# Altium schematic sheet sensor.SchDoc
size B; SheetNumber: 1; SheetTotal: 7
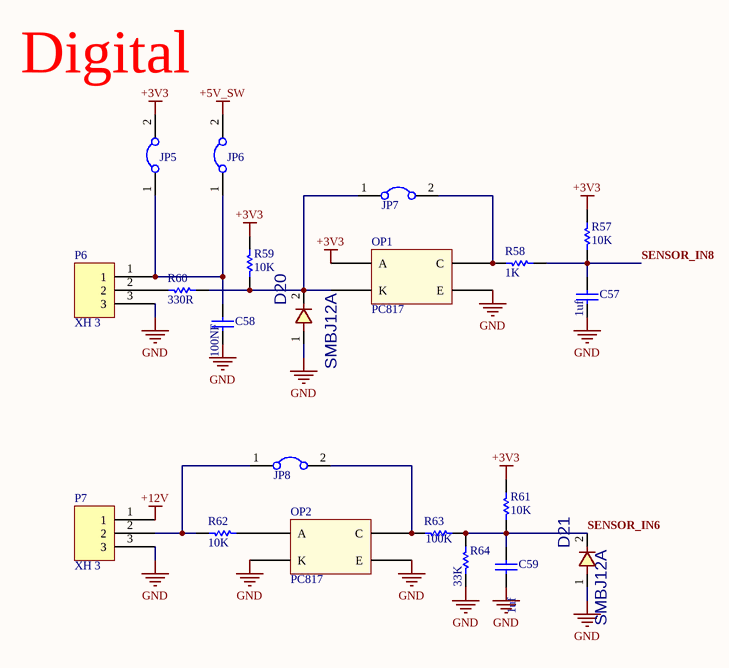
[diagram p0: sensor.SchDoc]

## Parts
C57  1uf  [CAP0603]
C58  100NF  [CAP0603]
C59  1uf  [CAP0603]
D20  value SMBJ12A  [D_SMB]  (hidden comment: SMBJ12A-TR SMD)
D21  value SMBJ12A  [D_SMB]  (hidden comment: SMBJ12A-TR SMD)
JP5  Jumper  [Jumper Small - 2.54 - GRAY]  (value not drawn)
JP6  Jumper  [Jumper Small - 2.54 - GRAY]  (value not drawn)
JP7  Jumper  [Jumper Small - 2.54 - GRAY]  (value not drawn)
JP8  Jumper  [Jumper Small - 2.54 - GRAY]  (value not drawn)
OP1  PC817  [PC817 SMD]
OP2  PC817  [PC817 SMD]
P6  XH 3  [XH 3 PIN]
P7  XH 3  [XH 3 PIN]
R57  10K  [R0603]
R58  1K  [R0603]
R59  10K  [R0603]
R60  330R  [R0603]
R61  10K  [R0603]
R62  10K  [R0603]
R63  100K  [R0603]
R64  33K  [R0603]

## Nets
+3V3: JP5.2 OP1.1(A) R57.2 R59.2 R61.2
+5V_SW: JP6.2
+12V: P7.1
GND: C57.1 C58.1 C59.1 D20.1 D21.1 OP1.3(E) OP2.2(K) OP2.3(E) P6.3 P7.3 R64.1
SENSOR_IN6: C59.2 D21.2 R61.1 R63.2 R64.2
SENSOR_IN8: C57.2 R57.1 R58.2
NetC58_2: C58.2 JP5.1 JP6.1 P6.1
NetD20_2: D20.2 JP7.1 OP1.2(K) R59.1 R60.2
NetJP7_2: JP7.2 OP1.4(C) R58.1
NetJP8_1: JP8.1 P7.2 R62.1
NetJP8_2: JP8.2 OP2.4(C) R63.1
NetOP2_1: OP2.1(A) R62.2
NetP6_2: P6.2 R60.1

## Notes on the sheet
- Digital

## Library data of the parts
C57 C59 = CAP SMD PACKAGE: TOTAL CAPACITOR SMD PACK; Designer: Abbas Basereh; Desc.: CAP SMD TOTAL PACKAGES; VALUE: 100nF; Data: 2017-3-10
C58 = CAP SMD PACKAGE: TOTAL CAPACITOR SMD PACK; Designer: Abbas Basereh; Desc.: CAP SMD TOTAL PACKAGES; Data: 2017-3-10; VALUE: 100nF
D20 D21 = SMBJ12A-TR SMD: TVS Surface Mount Transient Voltage Suppressors Diode; ComponentLink1Description: Tarahiboard; ComponentLink1URL: https://www.tarahiboard.com/product/library-pack; DatasheetVersion: 2022
JP5-JP8 = Jumper: Company: E.P.I.L; Defualt State: Close; Design Date: 2011/11/02
OP1 OP2 = PC817: PC817 optocpler; ComponentLink2Description: Website Smart World; ComponentLink2URL: https://www.smartw.ir/; ComponentLink3Description: Telegram; ComponentLink3URL: https://t.me/altium_smartw; ComponentLink4Description: Instagram; ComponentLink4URL: https://Instagram.com/smartgw.ir; DatasheetVersion: 2021
P6 P7 = Conector XH 3 Pin: ComponentLink1Description: Tarahiboard; ComponentLink1URL: https://www.tarahiboard.com/product/library-pack; DatasheetVersion: 2022
R57-R64 = Resistor SMD 0603: DatasheetVersion: 2021
  R57 R59 R61 R62: Value: 10K
  R58: Value: 1K
  R60: Value: 330R